# EAGLE design untitled (EAGLE 7.2.0)
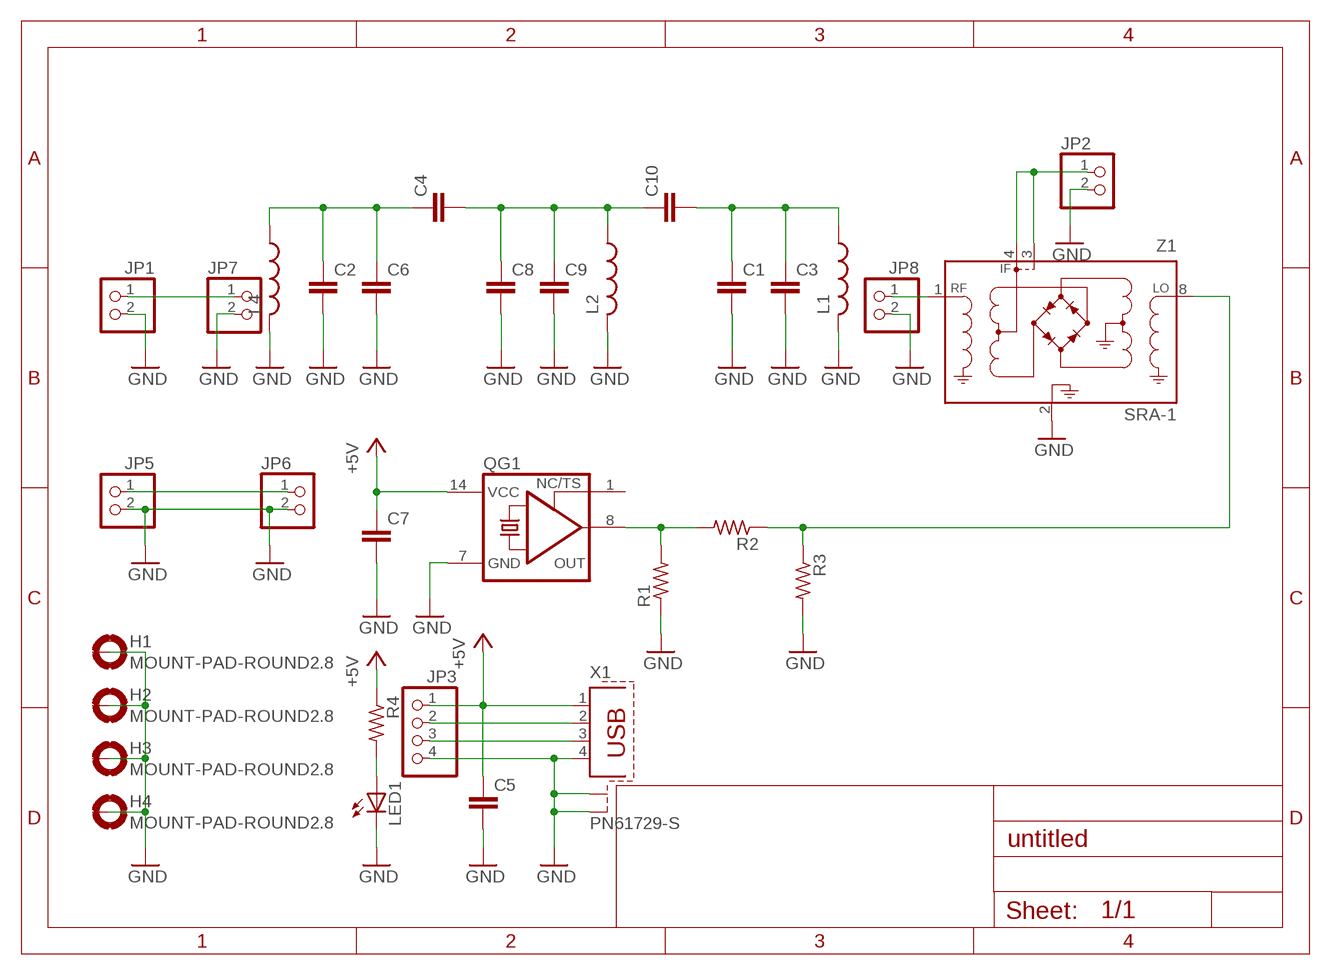
[diagram p0: schematic, sheet 1]

## Parts
C1  C5/2.5  [C5B2.5]
C2  C5/2.5  [C5B2.5]
C3  C5/2.5  [C5B2.5]
C4  C5/2.5  [C5B2.5]
C5  C5/2.5  [C5B2.5]
C6  C5/2.5  [C5B2.5]
C7  C5/2.5  [C5B2.5]
C8  C5/2.5  [C5B2.5]
C9  C5/2.5  [C5B2.5]
C10  C5/2.5  [C5B2.5]
H1  MOUNT-PAD-ROUND2.8  [2,8-PAD]
H2  MOUNT-PAD-ROUND2.8  [2,8-PAD]
H3  MOUNT-PAD-ROUND2.8  [2,8-PAD]
H4  MOUNT-PAD-ROUND2.8  [2,8-PAD]
JP1  PINHD-1X2  [1X02]
JP2  PINHD-1X2  [1X02]
JP3  PINHD-1X4  [1X04]
JP5  PINHD-1X2  [1X02]
JP6  PINHD-1X2  [1X02]
JP7  PINHD-1X2  [1X02]
JP8  PINHD-1X2  [1X02]
L1  L-US0207/7  [0207/7]
L2  L-US0207/7  [0207/7]
L4  L-US0207/7  [0207/7]
LED1  LED3MM  [LED3MM]
QG1  XO-14  [DIL14S]
R1  R-US_0207/7  [0207/7]
R2  R-US_0207/7  [0207/7]
R3  R-US_0207/7  [0207/7]
R4  R-US_0207/7  [0207/7]
X1  PN61729-S  [PN61729-S]
Z1  SRA-1  [A01]

## Nets
+5V: C5.1 C7.1 JP3.1 QG1.14(VCC) R4.1 X1.1
GND: C1.2 C2.2 C3.2 C5.2 C6.2 C7.2 C8.2 C9.2 JP1.2 JP2.2 JP3.4 JP5.2 JP6.2 JP7.2 JP8.2 L1.2 L2.2 L4.2 LED1.K(C) QG1.7(GND) R1.1 R3.2 X1.4 X1.S1 X1.S2 Z1.2(CASEGROUND)
N$1: JP1.1 JP7.1
N$2: C2.1 C4.1 C6.1 L4.1
N$3: C1.1 C3.1 C10.2 L1.1
N$4: JP8.1 Z1.1(R)
N$5: JP2.1 Z1.3(IF) Z1.4(IF)
N$6: QG1.8(OUT) R1.2 R2.2
N$7: R2.1 R3.1 Z1.8(L)
N$8: LED1.A R4.2
N$9: JP3.2 X1.2
N$10: JP3.3 X1.3
N$11: C4.2 C8.1 C9.1 C10.1 L2.1
N$13: JP5.1 JP6.1
Unconnected: H1.B2,8(MOUNT) H2.B2,8(MOUNT) H3.B2,8(MOUNT) H4.B2,8(MOUNT) QG1.1(TS)

## Power pins joined to a net without a drawn wire
GND: Z1.5(GND) Z1.6(GND) Z1.7(GND)

## Library data of the parts
C1-C10 = capacitor-wima:C: CAPACITOR naming: grid - package width
H1-H4 = holes:MOUNT-PAD-ROUND: MOUNTING PAD, round
JP1 JP2 JP5-JP8 = pinhead:PINHD-1X2: PIN HEADER
JP3 = pinhead:PINHD-1X4: PIN HEADER
L1 L2 L4 = rcl:L-US: INDUCTOR, American symbol
LED1 = led:LED: LED OSRAM: - CHIPLED LG R971, LG N971, LY N971, LG Q971, LY Q971, LO R971, LY R971 LH N974, LH R974 LS Q976, LO Q976, LY Q976 LO Q996 - Hyper CHIPLED LW Q18S LB Q993, LB Q99A, LB R99A - SideLED LS A670, LO A670, LY A670, LG A670, LP A670 LB A673, LV A673, LT A673, LW A673 LH A674 LY A675 LS A676, LA A676, LO A676, LY A676, LW A676 LS A679, LY A679, LG A679 - Hyper Micro SIDELED® LS Y876, LA Y876, LO Y876, LY Y876 LT Y87S - SmartLED LW L88C, LW L88S LB L89C, LB L89S, LG L890 LS L89K, LO L89K, LY L89K LS L896, LA L896, LO L896, LY L896 - TOPLED LS T670, LO T670, LY T670, LG T670, LP T670 LSG T670, LSP T670, LSY T670, LOP T670, LYG T670 LG T671, LOG T671, LSG T671 LB T673, LV T673, LT T673, LW T673 LH T674 LS T676, LA T676, LO T676, LY T676, LB T676, LH T676, LSB T676, LW T676 LB T67C, LV T67C, LT T67C, LS T67K, LO T67K, LY T67K, LW E67C LS E67B, LA E67B, LO E67B, LY E67B, LB E67C, LV E67C, LT E67C LW T67C LS T679, LY T679, LG T679 LS T770, LO T770, LY T770, LG T770, LP T770 LB T773, LV T773, LT T773, LW T773 LH T774 LS E675, LA E675, LY E675, LS T675 LS T776, LA T776, LO T776, LY T776, LB T776 LHGB T686 LT T68C, LB T68C - Hyper Mini TOPLED® LB M676 - Mini TOPLED Santana® LG M470 LS M47K, LO M47K, LY M47K Source: http://www.osram.convergy.de LUXEON: - LUMILED® LXK2-PW12-R00, LXK2-PW12-S00, LXK2-PW14-U00, LXK2-PW14-V00 LXK2-PM12-R00, LXK2-PM12-S00, LXK2-PM14-U00 LXK2-PE12-Q00, LXK2-PE12-R00, LXK2-PE12-S00, LXK2-PE14-T00, LXK2-PE14-U00 LXK2-PB12-K00, LXK2-PB12-L00, LXK2-PB12-M00, LXK2-PB14-N00, LXK2-PB14-P00, LXK2-PB14-Q00 LXK2-PR12-L00, LXK2-PR12-M00, LXK2-PR14-Q00, LXK2-PR14-R00 LXK2-PD12-Q00, LXK2-PD12-R00, LXK2-PD12-S00 LXK2-PH12-R00, LXK2-PH12-S00 LXK2-PL12-P00, LXK2-PL12-Q00, LXK2-PL12-R00 Source: www.luxeon.com KINGBRIGHT: KA-3528ASYC Source: www.kingbright.com
QG1 = crystal:XO-: CRYSTAL; OC_FARNELL: unknown; OC_NEWARK: unknown
R1-R4 = rcl:R-US_: RESISTOR, American symbol
X1 = con-berg:PN61729-S: BERG USB connector; OC_FARNELL: unknown; OC_NEWARK: unknown
Z1 = minicircuits:SRA-1: Frequency Mixer Level 7 (LO Power + 7 dBm) Source: minicircuits.com .. SRA-1+.pdf; OC_FARNELL: unknown; OC_NEWARK: unknown

## Board
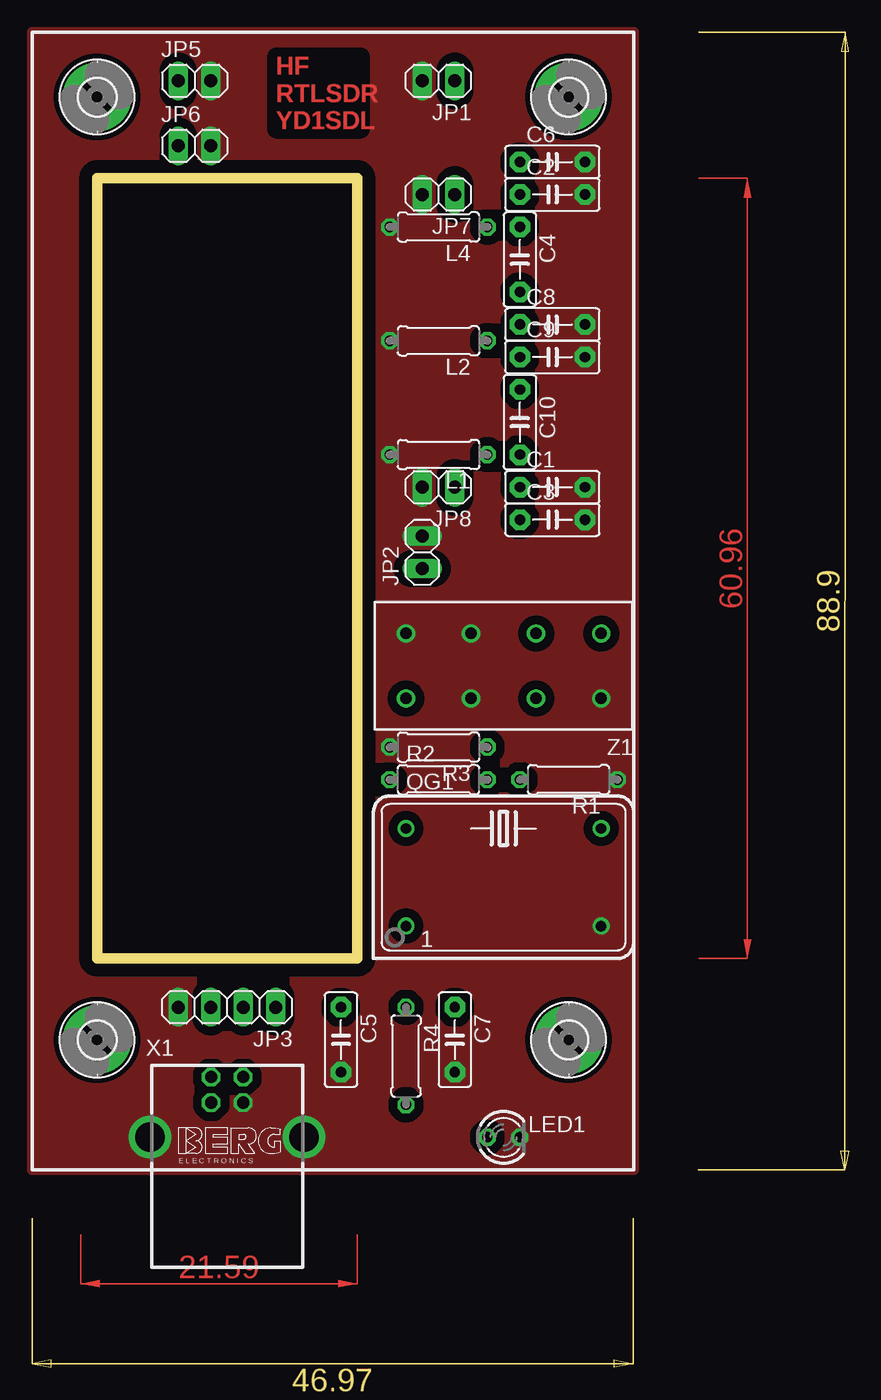
[diagram p1: board, top side]
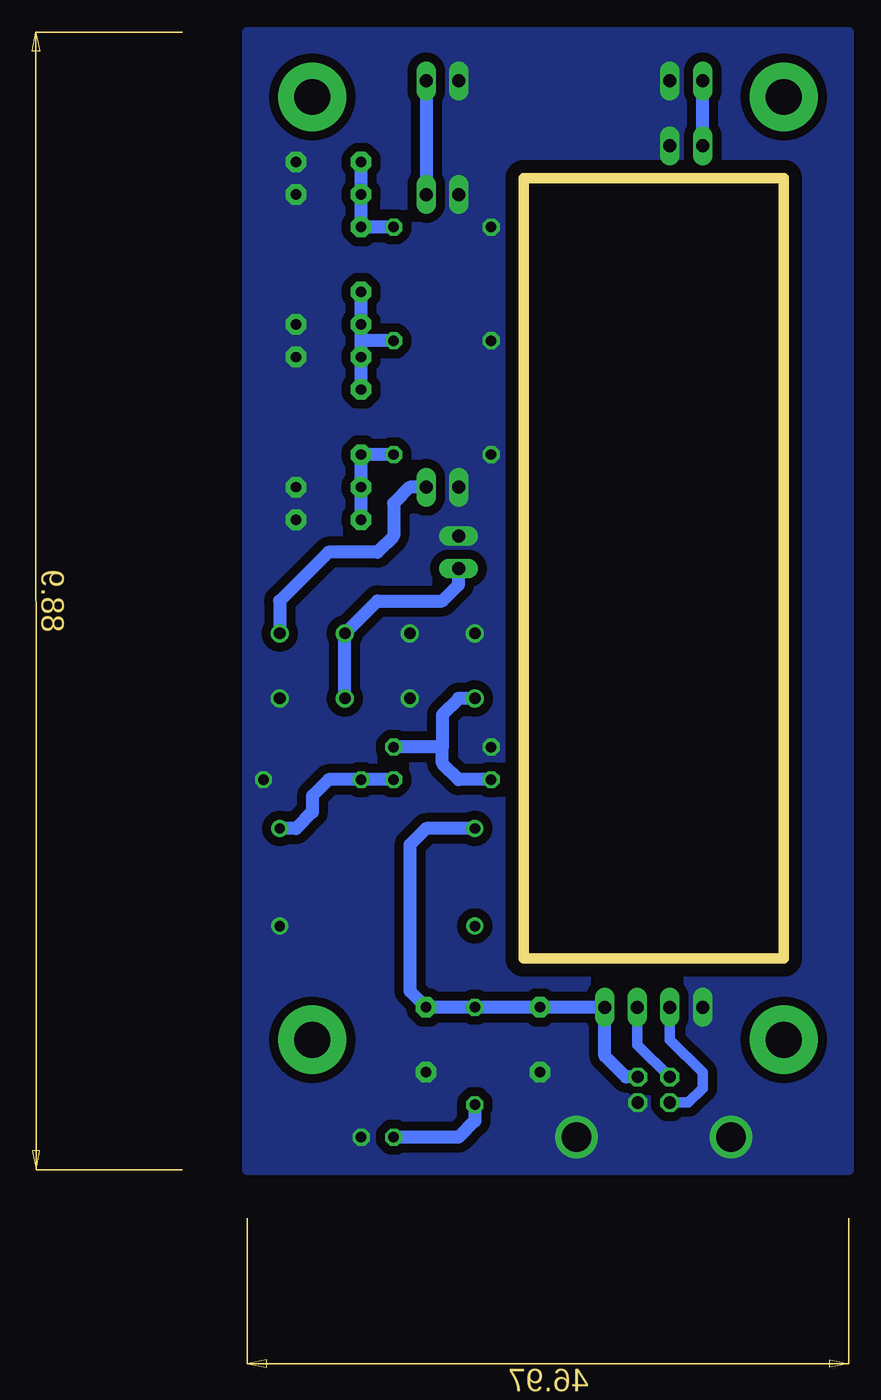
[diagram p2: board, bottom side, seen from below]

Size 63.8 x 104.35 mm. Coordinates in mm from the lower left corner, seen from the top.
Outline: 5.08,31.96 25.4,31.96 25.4,92.92 5.08,92.92 5.08,31.96
Copper layers (1*16): Top 0.035mm / dielectric 1.5mm / Bottom 0.035mm
Design rules "default": minimum track width 10mil, minimum drill 24mil, track to track 8mil, track to pad 8mil, pad to pad 8mil, via to via 8mil, smd to smd 8mil, copper to edge 40mil, drill to drill 8mil, minimum pad ring 10mil, minimum via ring 8mil, stop-mask expansion 4mil, vias tented up to drill 0mil, thermal gap 10mil

### Footprints (pad centres in the part's own frame; a part is rotated, then mirrored left to right if it is on the bottom)
C5B2.5 = drill 0.813 pad 1.6 octagon: 1 -2.54,0; 2 2.54,0
2,8-PAD = drill 2.8 pad 5.334: B2,8 0,0
1X02 = drill 1.016 long: 1 -1.27,0; 2 1.27,0
1X04 = drill 1.016 long: 1 -3.81,0; 2 -1.27,0; 3 1.27,0; 4 3.81,0
0207/7 = drill 0.813 octagon: 1 -3.81,0; 2 3.81,0
LED3MM = drill 0.813 octagon: A -1.27,0; K 1.27,0
DIL14S = drill 0.813: 1 -7.62,-3.81; 7 7.62,-3.81; 8 7.62,3.81; 14 -7.62,3.81
PN61729-S = drill 0.95 octagon: 1 1.25,4.71; 2 -1.25,4.71; 3 -1.25,2.71; 4 1.25,2.71 | drill 2.3 pad 2.9: S1 -6.02,0; S2 6.02,0
A01 = drill 0.9 pad 1.422: 1 -7.62,-2.54; 2 -7.62,2.54; 3 -2.54,-2.54; 4 -2.54,2.54; 5 2.54,-2.54; 6 2.54,2.54; 7 7.62,-2.54; 8 7.62,2.54

### Placement (x,y rotation side)
C1  40.64,68.79 0 top
C2  40.64,91.65 0 top
C3  40.64,66.25 0 top
C4  38.1,86.57 270 top
C5  24.13,25.61 270 top
C6  40.64,94.19 0 top
C7  33.02,25.61 270 top
C8  40.64,81.49 0 top
C9  40.64,78.95 0 top
C10  38.1,73.87 270 top
H1  5.08,25.61 0 top
H2  41.91,25.61 0 top
H3  5.08,99.27 0 top
H4  41.91,99.27 0 top
JP1  31.75,100.54 180 top
JP2  30.48,63.71 90 top
JP3  15.24,28.15 180 top
JP5  12.7,100.54 0 top
JP6  12.7,95.46 0 top
JP7  31.75,91.65 180 top
JP8  31.75,68.79 180 top
L1  31.75,71.33 180 top
L2  31.75,80.22 180 top
L4  31.75,89.11 180 top
LED1  36.83,17.99 0 top
QG1  36.83,38.31 0 top
R1  41.91,45.93 180 top
R2  31.75,45.93 0 top
R3  31.75,48.47 180 top
R4  29.21,24.34 270 top
X1  15.24,17.99 0 top
Z1  36.83,54.82 180 top

### Tracks (layer width: path | path; a pad name or v marks a point on that pad's centre or on a via)
+5V
  Bottom 1.016: X1.1 17.41,22.7 19.05,24.34 JP3.1 C5.1 R4.1 C7.1 34.29,29.42 34.29,40.85 33.02,42.12 QG1.14
GND
  pour Top (isolate 0.7, no thermals): 0,104.35 46.99,104.35 46.99,15.45 0,15.45
  pour Bottom (isolate 0.7, no thermals): 0,104.35 46.99,104.35 46.99,15.45 0,15.45
N$1
  Bottom 1.016: JP1.1 JP7.1
N$2
  Bottom 1.016: C6.1 C2.1 C4.1 L4.1
N$3
  Bottom 1.016: C3.1 C1.1 C10.2 L1.1
N$4
  Bottom 1.016: JP8.1 34.29,68.79 35.56,67.52 35.56,64.98 36.83,63.71 40.64,63.71 44.45,59.9 Z1.1
N$5
  Bottom 1.016: Z1.4 Z1.3 36.83,59.9 31.75,59.9 30.48,61.17 JP2.1
N$6
  Bottom 1.016: R2.2 R1.2 40.64,45.93 41.91,44.66 41.91,43.39 43.18,42.12 QG1.8
N$7
  Bottom 1.016: Z1.8 30.48,52.28 31.75,51.01 31.75,48.47 | 31.75,48.47 R3.1 | R2.1 30.48,45.93 31.75,47.2 31.75,48.47
N$8
  Bottom 1.016: R4.2 29.21,19.26 30.48,17.99 LED1.A
N$9
  Bottom 0.813: JP3.2 16.51,25.22 X1.2
N$10
  Bottom 0.813: X1.3 12.53,20.7 11.43,21.8 11.43,23.07 13.97,25.61 JP3.3
N$11
  Bottom 1.016: C10.1 C9.1 38.1,80.22 | 38.1,80.22 C8.1 C4.2 | L2.1 38.1,80.22
N$13
  Bottom 1.016: JP6.1 JP5.1
(copper drawn outside any net)
  shapes: Top area x2

### Text on the board
Top: HF / RTLSDR / YD1SDL